# EAGLE design CAN Adapter (EAGLE 9.6.2)
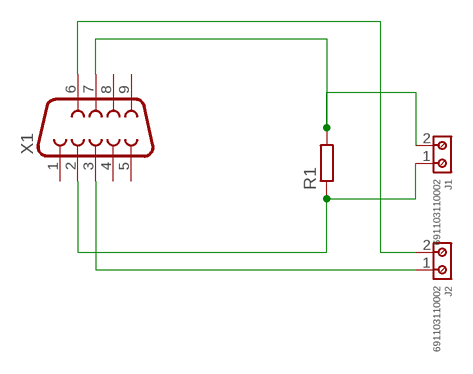
[diagram p0: schematic, sheet 1]

## Parts
J1  691103110002  [691103110002]
J2  691103110002  [691103110002]
R1  R-EU_0204/7  [0204/7]
X1  F09D  [F09D]

## Nets
N$1: J1.1 R1.1 X1.2
N$2: J1.2 R1.2 X1.7
N$3: J2.1 X1.3
N$4: J2.2 X1.6
Unconnected: X1.1 X1.4 X1.5 X1.8 X1.9

## Library data of the parts
J1 J2 = Wurth_Connectors_WR-TBL Wire Protector:691103110002: WR-TBL Serie 1031 - 3.50 mm Horiz. Entry Modular KIND PROPERTIES Pitch 3.5 mm MATERIAL PROPERTIES Insulator Material PA66 Insulator Flammability Rating UL94 V-0 Insulator Color Blue Contact Material Brass Contact Plating Copper over Zinc Terminal Screw Material Steel Terminal Screw Plating Zinc Wire Guard Material Stainless Steel GENERAL INFORMATION Operating Temperature -40 up to +105 °C Compliance Lead free / RoHS ELECTRICAL PROPERTIES IR UL 10 A Working Voltage [UL] 125 V (AC) Withstanding Voltage [UL] 1250 V (AC) Contact Resistance 20 mΩ Contact Resistance [UL] 20 mΩ MECHANICAL PROPERTIES Wire Strip Length 5 up to 6 (mm) Screw M2 Solid Wire Section (AWG) 26 to 16 (AWG) Solid Wire Section (Metric) 0.129 to 1.31 (mm²) Stranded Wire Section (AWG) 26 to 16 (AWG) Stranded Wire Section (Metric) 0.129 to 1.31 (mm²) CERTIFICATION UL Approval E315414 PACKAGING PROPERTIES Packaging Box <https://katalog.we-online.com/media/images/v2/o33226v209%20Family_WR-TBL_69110311000x.jpg> Details see: https://katalog.we-online.com/en/em/TBL_3_50_1031_6911031100XX Updated by Ella Wu 2019-11-07 2019(C) Wurth Elektronik; DATASHEET-URL: https://www.we-online.com/catalog/datasheet/691103110002.pdf; IR-UL: 10A; MOUNT: THT; PART-NUMBER: 691103110002; PINS: 2; PITCH: 3.5mm; TYPE: Horizontal; WIRE: 26 to 16 (AWG) 0.129 to 1.31 (mm²); WORKING-VOLTAGE-UL: 125V(AC)
R1 = resistor:R-EU_: RESISTOR, European symbol
X1 = con-subd:F09: SUB-D; OC_FARNELL: unknown; OC_NEWARK: unknown

## Board
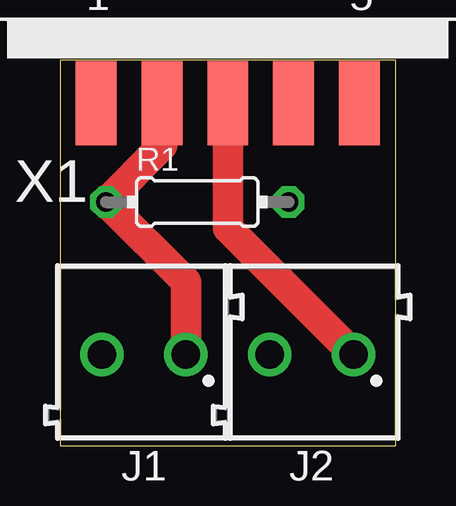
[diagram p1: board, top side]
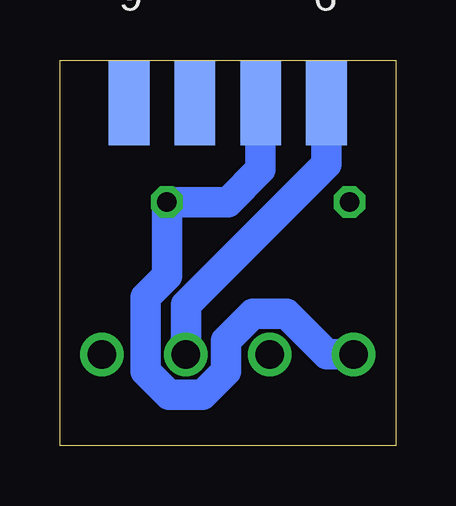
[diagram p2: board, bottom side, seen from below]

Size 14 x 16.08 mm. Coordinates in mm from the lower left corner, seen from the top.
Outline: 0,0 14,0 14,16.08 0,16.08 0,0
Copper layers (1*16): Top 0.035mm / dielectric 1.5mm / Bottom 0.035mm
Design rules "default *": minimum track width 6mil, minimum drill 0.35mm, track to track 6mil, track to pad 6mil, pad to pad 6mil, via to via 6mil, smd to smd 6mil, copper to edge 4mil, drill to drill 6mil, minimum pad ring 10mil, minimum via ring 8mil, stop-mask expansion 4mil, vias tented up to drill 0mil, thermal gap 10mil

### Footprints (pad centres in the part's own frame; a part is rotated, then mirrored left to right if it is on the bottom)
691103110002 = drill 1.2: 1 -1.75,0; 2 1.75,0
0204/7 = drill 0.813 octagon: 1 -3.81,0; 2 3.81,0
F09D = smd 1.7 x 3.5: 1 -5.486,-6.045; 2 -2.743,-6.045; 3 0,-6.045; 4 2.743,-6.045; 5 5.486,-6.045 | smd 1.7 x 3.5 bottom: 6 -4.115,-6.045; 7 -1.372,-6.045; 8 1.372,-6.045; 9 4.115,-6.045

### Placement (x,y rotation side)
J1  3.5,3.81 180 top
J2  10.5,3.81 180 top
R1  5.73,10.16 0 top
X1  7,20.32 0 top

### Tracks (layer width: path | path; a pad name or v marks a point on that pad's centre or on a via)
N$1
  Top 1.27: X1.2 4.26,12.5 R1.1 5.25,6.83 J1.1
N$2
  Bottom 1.27: X1.7 5.63,11.53 7,10.16 R1.2 9.54,7.09 10.44,6.19 10.44,3.11 9.45,2.12 8.05,2.12 7.06,3.11 7.06,4.38 5.95,5.5 4.55,5.5 2.86,3.81 J1.2
N$3
  Top 1.27: X1.3 7,9.06 J2.1
N$4
  Bottom 1.27: X1.6 2.88,11.73 8.75,5.87 J2.2